# Altium schematic sheet Telemetry_868Mhz.SchDoc
size A4
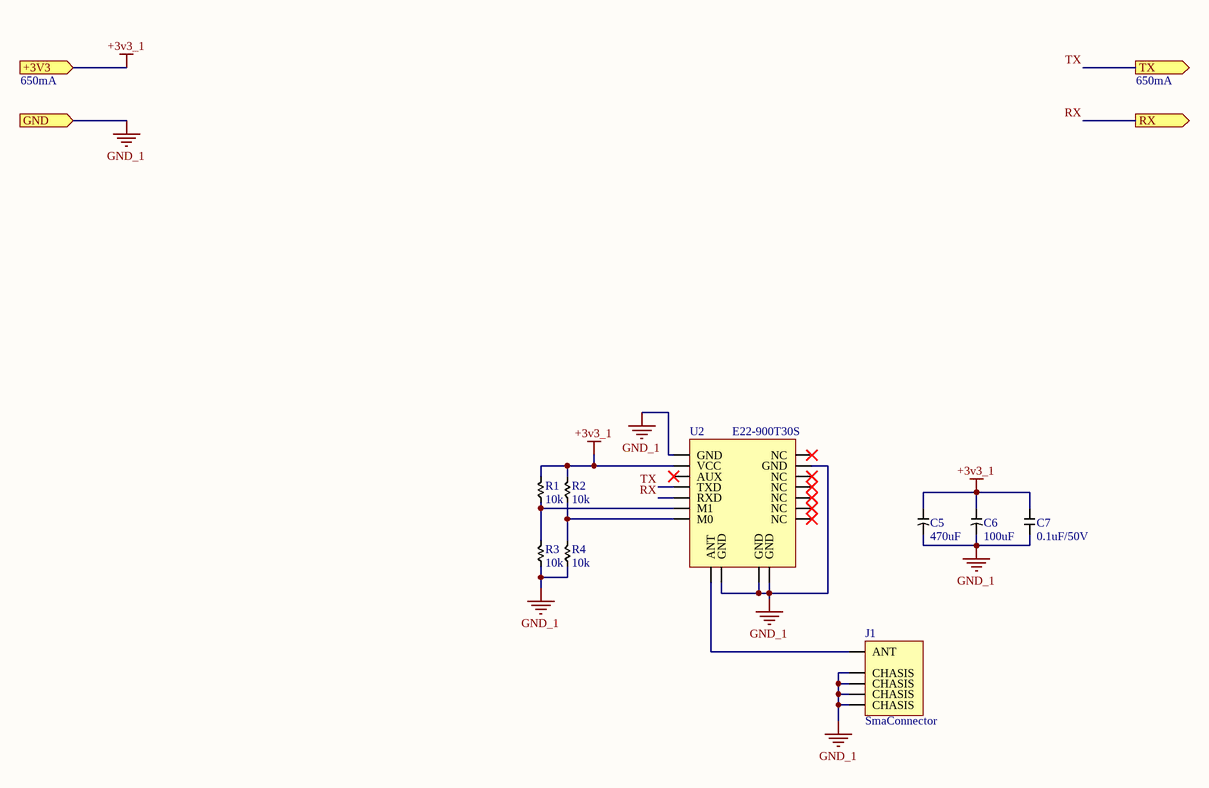
[diagram p0: Telemetry_868Mhz.SchDoc]

## Parts
C5  470uF  [BXJ25VC470MJ10TP]
C6  100uF  [BXJ25VC470MJ10TP]
C7  0.1uF/50V  [Cap_0805]
J1  SmaConnector  [RightAngled_SMA_Connector]
R1  10k  [RES_0805]
R2  10k  [RES_0805]
R3  10k  [RES_0805]
R4  10k  [RES_0805]
U2  E22-900T30S  [E22-900T30S]

## Ports
+3V3 (in), GND (in), RX (out), TX (out)

## Nets
+3v3_1: C5.1 C6.1 C7.1 R1.2 R2.2 U2.6(VCC) ; port +3V3
GND_1: C5.2 C6.2 C7.2 J1.2(CHASIS) J1.3(CHASIS) J1.4(CHASIS) J1.5(CHASIS) R3.1 R4.1 U2.7(GND) U2.9(GND) U2.15(GND) U2.16(GND) U2.17(GND) ; port GND
RX: U2.3(RXD) ; port RX
TX: U2.4(TXD) ; port TX
NetJ1_1: J1.1(ANT) U2.18(ANT)
NetR1_1: R1.1 R3.2 U2.2(M1)
NetR2_1: R2.1 R4.2 U2.1(M0)

Not connected (* = marked no-connect by the designer): U2 5(AUX)* 8(NC)* 10(NC)* 11(NC)* 12(NC)* 13(NC)* 14(NC)*

## Notes on the sheet
- 650mA
- Size:
- Title
- A4
- DrawnBy
- Revision:
- YBU
- Batı Kampüsü
- Etlik Keçiören
- Date:
- Time:
- Sheet
- of
- Ankara / Türkiye

## Library data of the parts
C5 = BXJ25VC470MJ10TP: CAP.EL.470uF 25V 10x10 105C 5000Hrs SMD; ComponentLink1Description: özdisan; ComponentLink1URL: https://ozdisan.com/passive-components/capacitors/aluminum-capacitors/BXJ25VC470MJ10TP
C6 = CK1H107M10010VR: CAP.EL.100uF 50V 10x10 105C SMD SAMWHA; ComponentLink1Description: özdisan; ComponentLink1URL: https://ozdisan.com/passive-components/capacitors/aluminum-capacitors/CK1H107M10010VR
C7 = CL21B104JBCNNNC: MLCC (2012) 0805 100nF 50VDC ±5% X7R
J1 = L-KLS1-SMA002-B: RP-SMA Connector Receptacle, Male Pin 50Ohm Through Hole, Right Angle Solder; ComponentLink1Description: özdisan; ComponentLink1URL: https://ozdisan.com/connectors-and-interconnects/coaxial-connectors/sma-connectors/L-KLS1-SMA002-B
R1-R4 = 0805S8J0103T5E: RES.(2012) 0805 10K Ohms 5% 1/8W-S 100PPM
U2 = E22-900T30S: https://www.m2mmarket.com.tr/lora-868mhz-1w-smd-long-range-5v-supplyrf-transmission-30-dbm-10-k-2153